# Altium schematic sheet Antenna Supervisory Circuit.SchDoc
size A; SheetNumber: 2; SheetTotal: 4
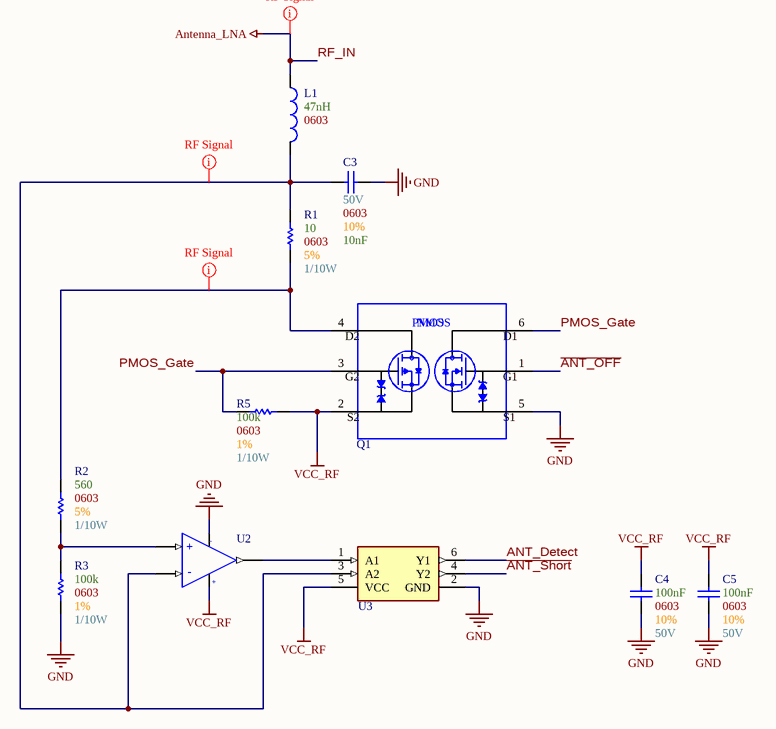
[diagram p0: Antenna Supervisory Circuit.SchDoc]

## Parts
C3  Max Voltage: 50V  Size Package: 0603  Tolerance: 10%  Capacitance: 10nF  [[Cap] SMD 0603]  (hidden comment: [Cap] 0603 0.01uF 10% 50V)
C4  Max Voltage: 50V  Size Package: 0603  Tolerance: 10%  Capacitance: 100nF  [[Cap] SMD 0603]  (hidden comment: [Cap] 0603 0.1uF 10% 50V)
C5  Max Voltage: 50V  Size Package: 0603  Tolerance: 10%  Capacitance: 100nF  [[Cap] SMD 0603]  (hidden comment: [Cap] 0603 0.1uF 10% 50V)
L1  Package: 0603  Inductance: 47nH  [[Inductor] SMD 0603]  (hidden comment: [47nH] SMD 0603 90mA)
Q1  N/PMOS  [SOT-26]  (value not drawn)
R1  Wattage: 1/10W  Tolerance: 5%  Resistance: 10  Size Package: 0603  [[Res] SMD 0603]  (hidden comment: [10] SMD 0603 5% 1/10W)
R2  Wattage: 1/10W  Tolerance: 5%  Resistance: 560  Size Package: 0603  [[Res] SMD 0603]  (hidden comment: [560] SMD 0603 5% 1/10W)
R3  Wattage: 1/10W  Tolerance: 1%  Resistance: 100k  Size Package: 0603  [[Res] SMD 0603]  (hidden comment: [100k] SMD 0603 1% 1/10W)
R5  Wattage: 1/10W  Tolerance: 1%  Resistance: 100k  Size Package: 0603  [[Res] SMD 0603]  (hidden comment: [100k] SMD 0603 1% 1/10W)
U2  [Op-Amp] Rail-to-Rail Vmax=16V GBP=3kHz  [[Op-Amp] Rail-to-Rail Vmax=16V GBP=3kHz]  (value not drawn)
U3  [Buffer] Dual Open Drain  [[Buffer] Dual Open Drain]  (value not drawn)

## Nets
GND: C3.1 C4.1 C5.1 Q1.5(S1) R3.1 U2.2(V-) U3.2(GND)
RF_IN: L1.1  [also labelled Antenna_LNA]
VCC_RF: C4.2 C5.2 Q1.2(S2) R5.1 U2.5(V+) U3.5(VCC)
~{ANT_OFF}: Q1.1(G1)
~{ANT_Short}: U3.4(Y2)
ANT_Detect: U3.6(Y1)
PMOS_Gate: Q1.3(G2) Q1.6(D1) R5.2
NetC3_2: C3.2 L1.2 R1.2 U2.4(-IN) U3.3(A2)
NetQ1_4: Q1.4(D2) R1.1 R2.2
NetR2_1: R2.1 R3.2 U2.3(+IN)
NetU2_1: U2.1(OUT) U3.1(A1)

## Layout directives
net class nRF Signal: NetC3_2, NetQ1_4, RF_IN

## Notes on the sheet
- (in symbol [NMOS, PMOS] FET Array 20V 1.14A) PMOS; NMOS
- (in symbol [Op-Amp] Rail-to-Rail Vmax=16V GBP=3kHz) -; +

## Library data of the parts
C3 = [Cap] 0603 0.01uF 10% 50V: C0603C103K5RACTU; Supplier 1: DigiKey; Supplier Part Number 1: 399-C0603C103K5RACTUDKR-ND
C4 C5 = [Cap] 0603 0.1uF 10% 50V: CL10B104KB8NNNC; Supplier 1: DigiKey; Supplier Part Number 1: 1276-1000-6-ND
L1 = [47nH] SMD 0603 90mA: AIMC-0603-47NJ-T; Supplier 1: DigiKey; Supplier Part Number 1: 535-11541-6-ND
Q1 = [NMOS, PMOS] FET Array 20V 1.14A: DMC2700UDM-7; Supplier 1: DigiKey; Supplier Part Number 1: DMC2700UDM-7DKR-ND
R1 = [10] SMD 0603 5% 1/10W: RC0603JR-1310RL; Supplier 1: DigiKey; Supplier Part Number 1: 13-RC0603JR-1310RLDKR-ND
R2 = [560] SMD 0603 5% 1/10W: RC0603JR-07560RL; Supplier 1: DigiKey; Supplier Part Number 1: 311-560GRDKR-ND
R3 R5 = [100k] SMD 0603 1% 1/10W: RC0603FR-07100KL; Supplier 1: DigiKey; Supplier Part Number 1: 311-100KHRDKR-ND
U2 = [Op-Amp] Rail-to-Rail Vmax=16V GBP=3kHz: LT6003CS5#TRMPBF; Supplier 1: DigiKey; Supplier Part Number 1: 505-LT6003CS5#TRMPBFCT-ND
U3 = [Buffer] Dual Open Drain: NC7WZ07P6X; Supplier 1: DigiKey; Supplier Part Number 1: NC7WZ07P6XDKR-ND